# Altium schematic sheet SOM.SchDoc
size 420 x 297 mm; Address1: Address1; Address2: Address2; Address3: Address3; Address4: Address4; SheetNumber: 9; SheetTotal: 10; DocumentType: Схема электрическая принципиальная
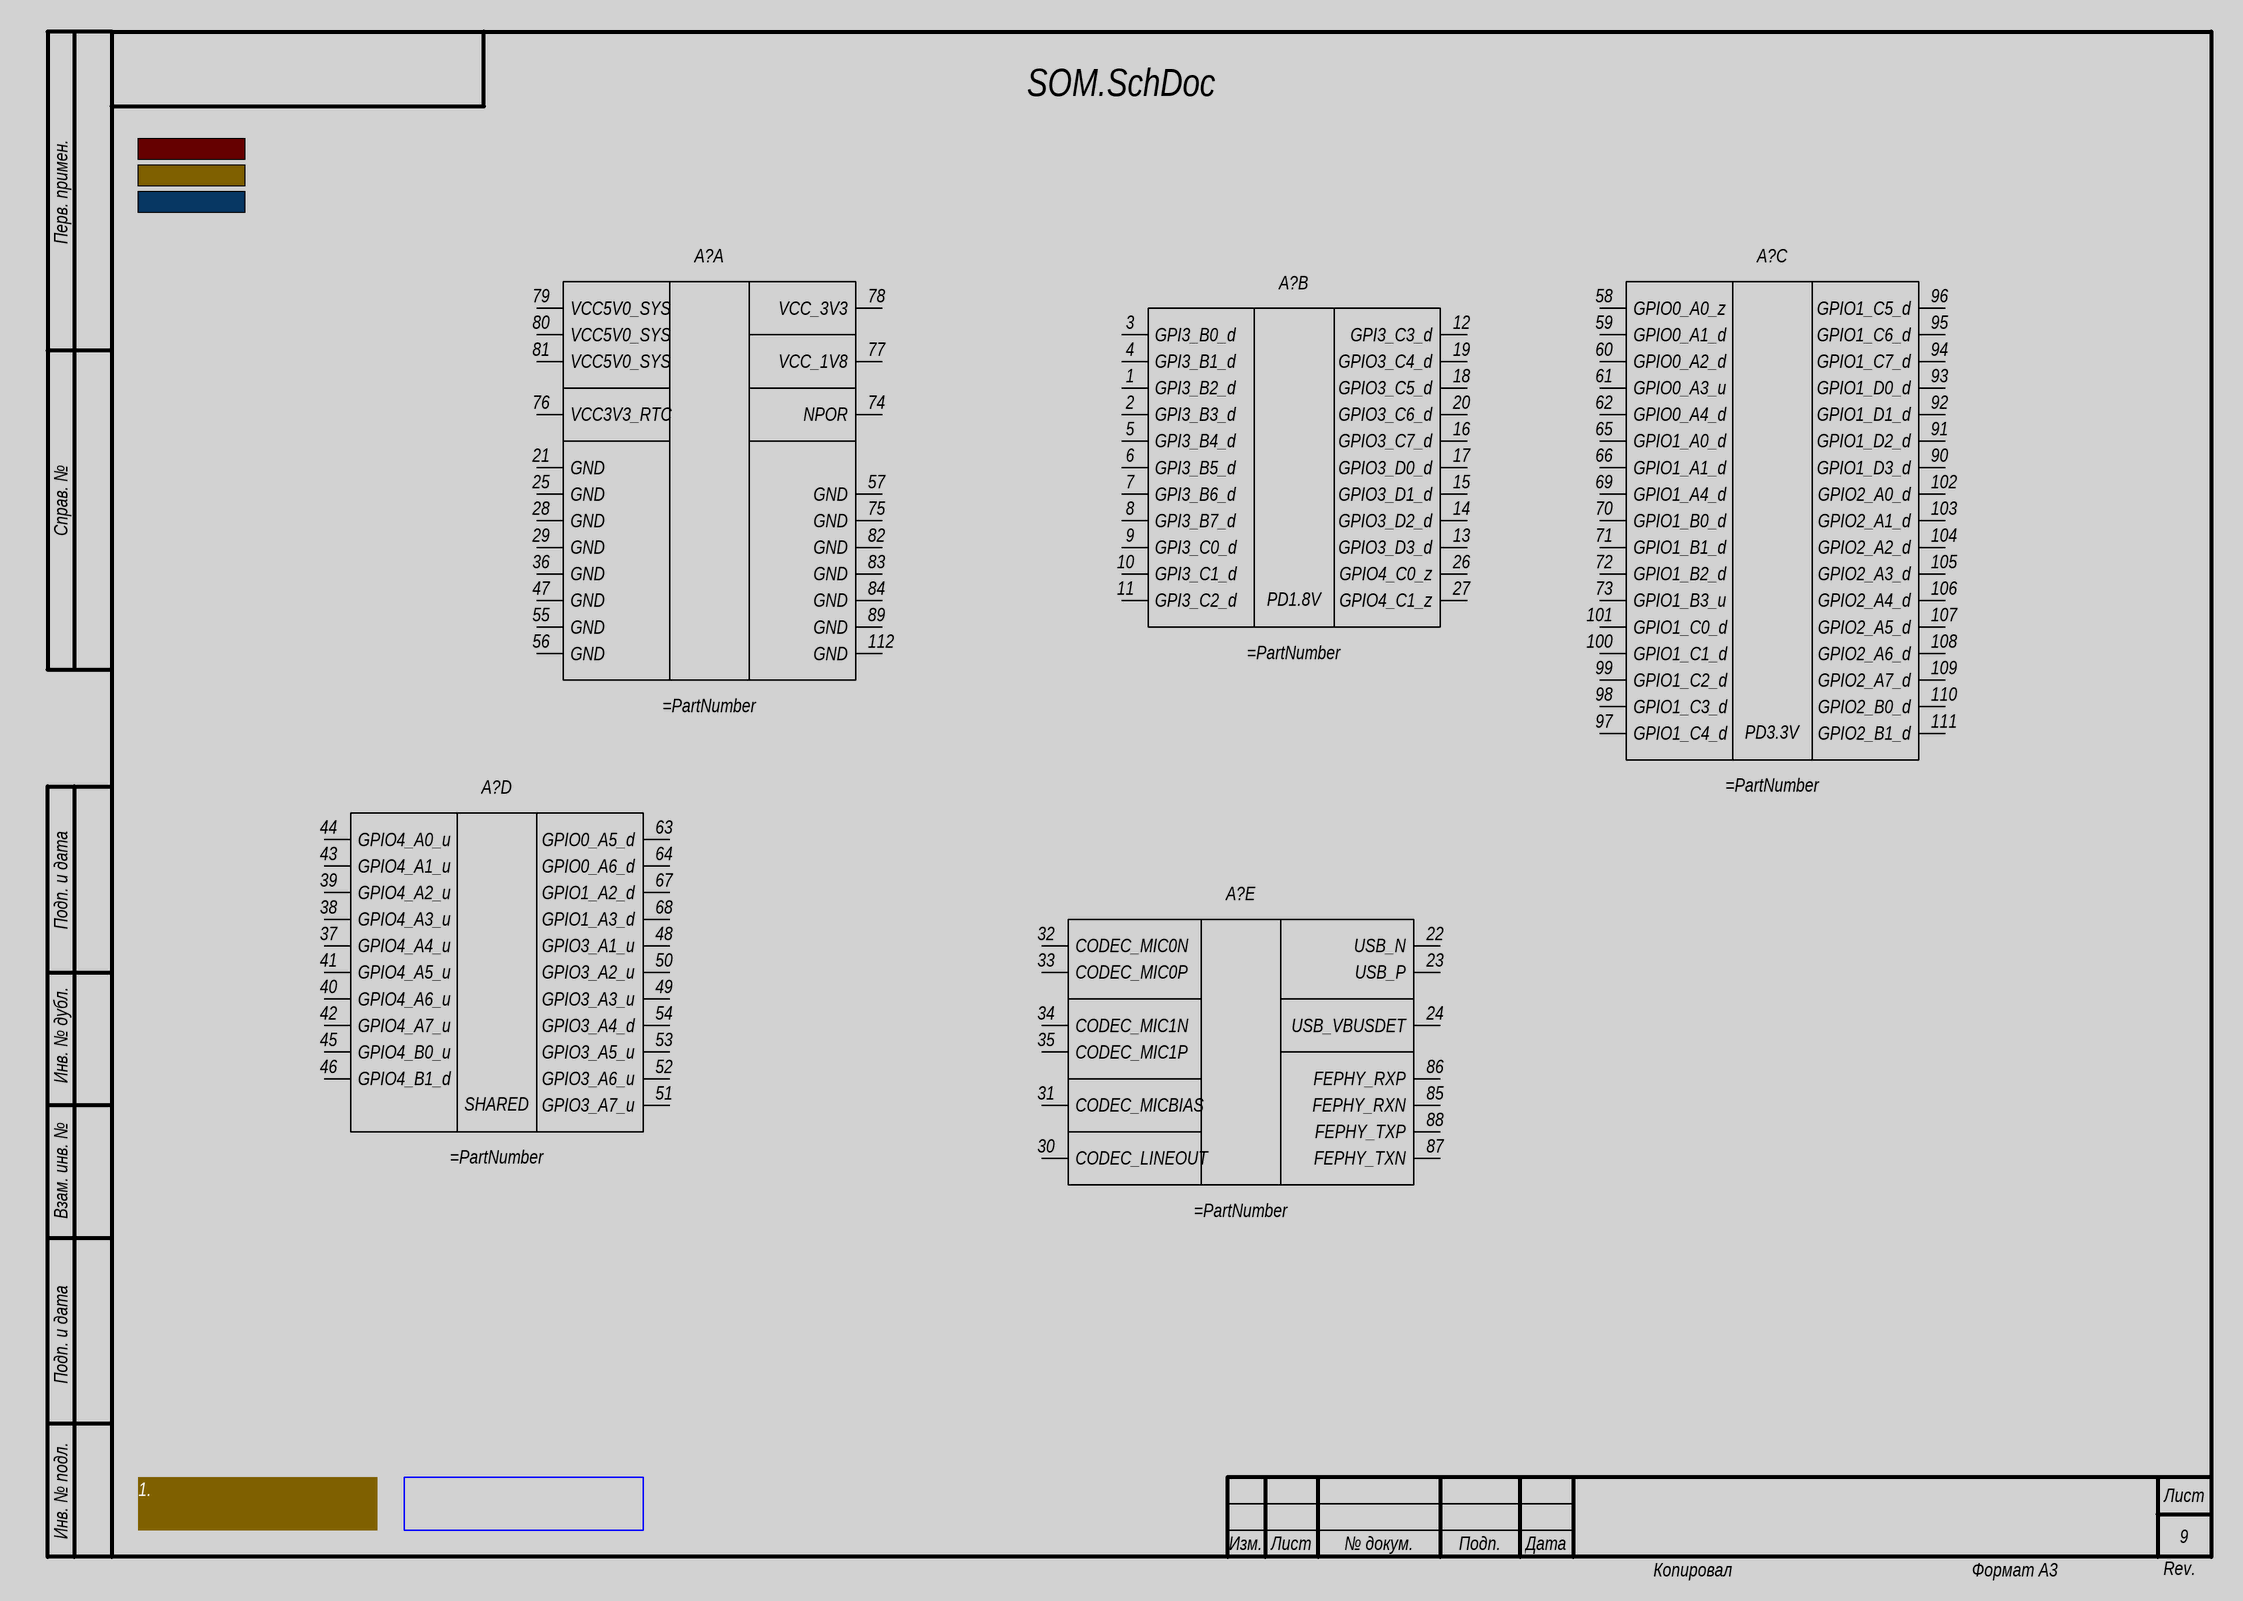
[diagram p0: SOM.SchDoc]

## Parts
(Parts that share a designator on the sheet are numbered #1, #2 ... from top to bottom, then left to right.)
A?#1  I  (value not drawn)  (part A of 5)
A?#2  I  (value not drawn)  (part C of 5)
A?#3  I  (value not drawn)  (part B of 5)
A?#4  I  (value not drawn)  (part D of 5)
A?#5  I  (value not drawn)  (part E of 5)

## Ports
 (in)

## Nets

Not connected (* = marked no-connect by the designer): A?#1 21(GND) 25(GND) 28(GND) 29(GND) 36(GND) 47(GND) 55(GND) 56(GND) 57(GND) 74(NPOR) 75(GND) 76(VCC3V3_RTC) 77(VCC_1V8) 78(VCC_3V3) 79(VCC5V0_SYS) 80(VCC5V0_SYS) 81(VCC5V0_SYS) 82(GND) 83(GND) 84(GND) 89(GND) 112(GND); A?#2 58(GPIO0_A0_z) 59(GPIO0_A1_d) 60(GPIO0_A2_d) 61(GPIO0_A3_u) 62(GPIO0_A4_d) 65(GPIO1_A0_d) 66(GPIO1_A1_d) 69(GPIO1_A4_d) 70(GPIO1_B0_d) 71(GPIO1_B1_d) 72(GPIO1_B2_d) 73(GPIO1_B3_u) 90(GPIO1_D3_d) 91(GPIO1_D2_d) 92(GPIO1_D1_d) 93(GPIO1_D0_d) 94(GPIO1_C7_d) 95(GPIO1_C6_d) 96(GPIO1_C5_d) 97(GPIO1_C4_d) 98(GPIO1_C3_d) 99(GPIO1_C2_d) 100(GPIO1_C1_d) 101(GPIO1_C0_d) 102(GPIO2_A0_d) 103(GPIO2_A1_d) 104(GPIO2_A2_d) 105(GPIO2_A3_d) 106(GPIO2_A4_d) 107(GPIO2_A5_d) 108(GPIO2_A6_d) 109(GPIO2_A7_d) 110(GPIO2_B0_d) 111(GPIO2_B1_d); A?#3 1(GPI3_B2_d) 2(GPI3_B3_d) 3(GPI3_B0_d) 4(GPI3_B1_d) 5(GPI3_B4_d) 6(GPI3_B5_d) 7(GPI3_B6_d) 8(GPI3_B7_d) 9(GPI3_C0_d) 10(GPI3_C1_d) 11(GPI3_C2_d) 12(GPI3_C3_d) 13(GPIO3_D3_d) 14(GPIO3_D2_d) 15(GPIO3_D1_d) 16(GPIO3_C7_d) 17(GPIO3_D0_d) 18(GPIO3_C5_d) 19(GPIO3_C4_d) 20(GPIO3_C6_d) 26(GPIO4_C0_z) 27(GPIO4_C1_z); A?#4 37(GPIO4_A4_u) 38(GPIO4_A3_u) 39(GPIO4_A2_u) 40(GPIO4_A6_u) 41(GPIO4_A5_u) 42(GPIO4_A7_u) 43(GPIO4_A1_u) 44(GPIO4_A0_u) 45(GPIO4_B0_u) 46(GPIO4_B1_d) 48(GPIO3_A1_u) 49(GPIO3_A3_u) 50(GPIO3_A2_u) 51(GPIO3_A7_u) 52(GPIO3_A6_u) 53(GPIO3_A5_u) 54(GPIO3_A4_d) 63(GPIO0_A5_d) 64(GPIO0_A6_d) 67(GPIO1_A2_d) 68(GPIO1_A3_d); A?#5 22(USB_N) 23(USB_P) 24(USB_VBUSDET) 30(CODEC_LINEOUT) 31(CODEC_MICBIAS) 32(CODEC_MIC0N) 33(CODEC_MIC0P) 34(CODEC_MIC1N) 35(CODEC_MIC1P) 85(FEPHY_RXN) 86(FEPHY_RXP) 87(FEPHY_TXN) 88(FEPHY_TXP)

## Notes on the sheet
- 1.
- Rev.
- Перв. примен.
- Справ. №
- Подп. и дата
- Инв. № дубл.
- Взам. инв. №
- Инв. № подл.
- Изм.
- Лист
- № докум.
- Подп.
- Дата
- Копировал
- Формат А3
- (in symbol Core1106, part B) PD1.8V
- (in symbol Core1106, part C) PD3.3V
- (in symbol Core1106, part D) SHARED

## Library data of the parts
A?#1-A?#5 = Core1106: RV1106 Development Board; Manufacturer: Shenzhen Luckfox Tecnology Co., Ltd.; TemperatureRange: -10...+80°C; ClassName: General; ComponentType: Модуль; Install: I